# EAGLE design emonDCduo-ESP v2.2 (EAGLE 8.3.1)
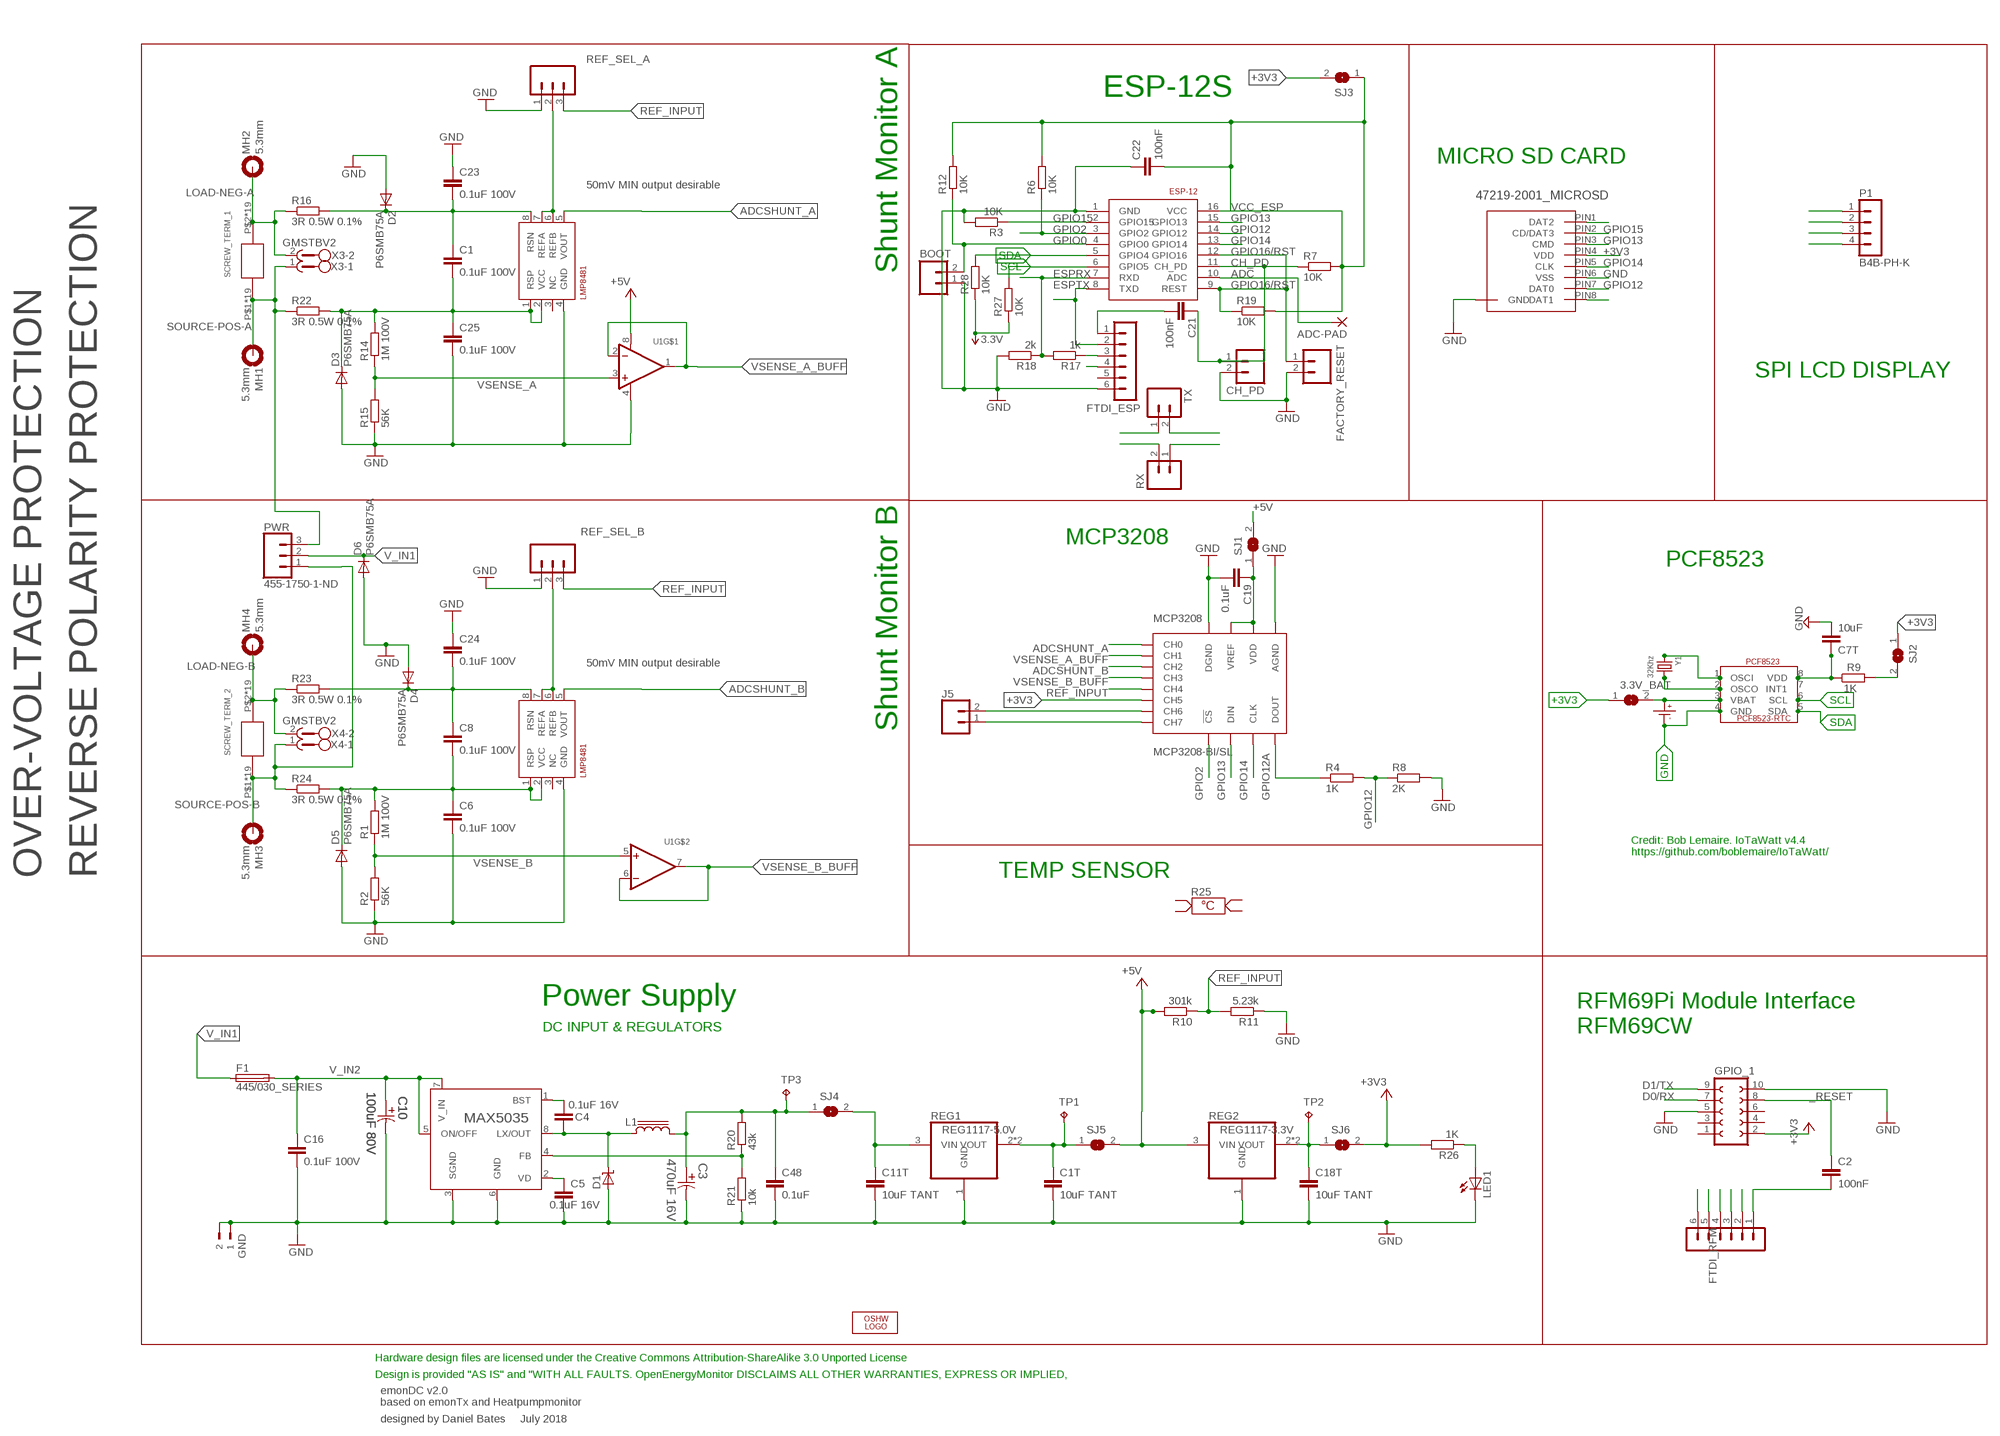
[diagram p0: schematic, sheet 1]

## Parts
3.3V_BAT  SJ-CONCON  [SJ-CON]
ADC-PAD  2,15/1,0  [2,15/1,0]
BOOT  M02PTH  [1X02]
C1  0.1uF 100V  C-EUC0603  [C0603]
C1T  10uF TANT  C-EUC0603  [C0603]
C2  100nF  C-EUC0603  [C0603]
C3  470uF 16V  EEE-FK1C471P-CASE-F  [CAPAE830X1050N]
C4  0.1uF 16V  C-EUC0603  [C0603]
C5  0.1uF 16V  C-EUC0603  [C0603]
C6  0.1uF 100V  C-EUC0603  [C0603]
C7T  10uF  C-EUC0603  [C0603]
C8  0.1uF 100V  C-EUC0603  [C0603]
C10  100uF 80V  EEV-FK1K101Q-CASE-H13  [CAPAE1350X1400N]
C11T  10uF TANT  C-EUC0603  [C0603]
C16  0.1uF 100V  C-EUC0603  [C0603]
C18T  10uF TANT  C-EUC0603  [C0603]
C19  0.1uF  C-EUC0603  [C0603]
C21  100nF  C-EUC0603  [C0603]
C22  100nF  C-EUC0603  [C0603]
C23  0.1uF 100V  C-EUC0603  [C0603]
C24  0.1uF 100V  C-EUC0603  [C0603]
C25  0.1uF 100V  C-EUC0603  [C0603]
C48  0.1uF  C-EUC0603  [C0603]
CH_PD  M02PTH  [1X02]
CR1220  CR1220SMD  [CR1220SMD]
D1  MBRS1100T3G  [SMB_1]
D2  P6SMB75A  DIODE-DO214AA  [DO214AA]
D3  P6SMB75A  DIODE-DO214AA  [DO214AA]
D4  P6SMB75A  DIODE-DO214AA  [DO214AA]
D5  P6SMB75A  DIODE-DO214AA  [DO214AA]
D6  P6SMB75A  DIODE-DO214AA  [DO214AA]
ESP-12  ESP8266_ESP-12  [ESP8266-ESP12]
F1  445/030_SERIES  [445/030_SERIES_LITTELFUSE]
FTDI_ESP  FTDI_ESP  MA06-1  [MA06-1]
FTDI_RFM  FTDI_RFM  MA06-1  [MA06-1]
GND  180-2  [180-2]
GPIO_1  FE05-2_RFM69PI_OUTLINERFM69PI  [FE05-2_RFM69PI_OULTINE]
IO16  FACTORY_RESET  M02PTH  [1X02]
J5  CONN_02  [1X02]
L1  SRR1208  [SSR1208]
LED1  LEDCHIP-LED0805  [CHIP-LED0805]
LOGO1  OSHW_LOGO_6MILX0200-NT  [OSHW_6X200_NOTEXT]
MCP3208  MCP3208-BI/SL  [SOIC16]
MH1  5.3mm  MOUNT-PAD-ROUND5.3  [5,3//11-PAD]
MH2  5.3mm  MOUNT-PAD-ROUND5.3  [5,3//11-PAD]
MH3  5.3mm  MOUNT-PAD-ROUND5.3  [5,3//11-PAD]
MH4  5.3mm  MOUNT-PAD-ROUND5.3  [5,3//11-PAD]
MICRO_SD  47219-2001_MICROSD  [47219-2001_MICROSD]
P1  B4B-PH-K  [B4B-PH-K]
PCF8523  PCF8523_RTC  [SOIC_8]
PWR  455-1750-1-ND  CONN_03  [1X03]
R1  1M 100V  R-EU_R0603  [R0603]
R2  56K  R-EU_R0603  [R0603]
R3  10K  R-EU_R0603  [R0603]
R4  1K  R-EU_R0603  [R0603]
R6  10K  R-EU_R0603  [R0603]
R7  10K  R-EU_R0603  [R0603]
R8  2K  R-EU_R0603  [R0603]
R9  1K  R-EU_R0603  [R0603]
R10  301k  R-EU_0204/7  [0204/7]
R11  5.23k  R-EU_0204/7  [0204/7]
R12  10K  R-EU_R0603  [R0603]
R14  1M 100V  R-EU_R0603  [R0603]
R15  56K  R-EU_R0603  [R0603]
R16  3R 0.5W 0.1%  R-EU_R0805  [R0805]
R17  1k  R-EU_R0603  [R0603]
R18  2k  R-EU_R0603  [R0603]
R19  10K  R-EU_R0603  [R0603]
R20  43k  R-EU_R0603  [R0603]
R21  10k  R-EU_R0603  [R0603]
R22  3R 0.5W 0.1%  R-EU_R0805  [R0805]
R23  3R 0.5W 0.1%  R-EU_R0805  [R0805]
R24  3R 0.5W 0.1%  R-EU_R0805  [R0805]
R25  3220824X  [PT1206]
R26  1K  R-EU_R0603  [R0603]
R27  10K  R-EU_R0603  [R0603]
R28  10K  R-EU_R0603  [R0603]
REF_SEL_A  455-1750-1-ND  CONN_03  [1X03]
REF_SEL_B  455-1750-1-ND  CONN_03  [1X03]
REG0  MAX5035  [21-0111D_SBE-14]
REG1  REG1117-5.0V  REG1117  [SOT223]
REG2  REG1117-3.3V  REG1117  [SOT223]
RX  M02PTH  [1X02]
SCREW_TERM_1  EBW_SERIES_15.2MM  [EBW_SERIES_15.2MM]
SCREW_TERM_2  EBW_SERIES_15.2MM  [EBW_SERIES_15.2MM]
SHUNTMON-A  LMP8481  LMP8481-H  [S-PDSO-G08]
SHUNTMON-B  LMP8481  LMP8481-H  [S-PDSO-G08]
SJ1  SJ-CONCON  [SJ-CON]
SJ2  SJ-CONCON  [SJ-CON]
SJ3  SJ-CONCON  [SJ-CON]
SJ4  SJ-CONCON  [SJ-CON]
SJ5  SJ-CONCON  [SJ-CON]
SJ6  SJ-CONCON  [SJ-CON]
TP1  TPPAD1-13  [P1-13]
TP2  TPPAD1-13  [P1-13]
TP3  TPPAD1-13  [P1-13]
TX  M02PTH  [1X02]
U1  LM358  [SOIC8_150MIL]
X3  GMSTBV2  [GMSTBV2]
X4  GMSTBV2  [GMSTBV2]
Y1  32Khz  CRYSTAL8X3.8SMT  [CRYSTAL_8X3.8]

## Nets
3.3V_PRE: C18T.1 REG2.2(VOUT) REG2.4(VOUT) SJ6.1 TP2.TP
5V_PRE [power]: C1T.1 REG1.2(VOUT) REG1.4(VOUT) SJ5.1 TP1.TP
6.5V: C11T.1 REG1.3(VIN) SJ4.2
+3V3: 3.3V_BAT.1 GPIO_1.2 MCP3208.6(CH5) MICRO_SD.PIN4(VDD) P1.3 R26.2 R27.1 R28.1 SJ2.1 SJ3.2 SJ6.2 ; supply symbol labelled 3.3V
+5V: FTDI_ESP.4 FTDI_RFM.4 R10.2 REG2.3(VIN) SJ1.2 SJ5.2 U1.8(V+)
_RESET: C2.1 GPIO_1.8
ADC: ADC-PAD.1(P) ESP-12.10(ADC)
ADCSHUNT_A: MCP3208.1(CH0) SHUNTMON-A.5(VOUT)
ADCSHUNT_B: MCP3208.3(CH2) SHUNTMON-B.5(VOUT)
BST: C4.1 REG0.1(BST)
CH6: J5.2 MCP3208.7(CH6)
CH7: J5.1 MCP3208.8(CH7)
CH_PD: C21.1 CH_PD.1 ESP-12.11(CH_PD) R7.1
D0/RX: FTDI_RFM.2 GPIO_1.7 TX.2
D1/TX: FTDI_RFM.3 GPIO_1.9 RX.1
ESPRX: ESP-12.7(RXD) R17.2 R18.1 RX.2
ESPTX: ESP-12.8(TXD) FTDI_ESP.2 TX.1
GND [thin_power]: BOOT.1 C1T.2 C3.2 C5.2 C6.2 C7T.2 C10.2 C11T.2 C16.2 C18T.2 C19.2 C22.1 C23.1 C24.1 C25.2 C48.2 CH_PD.2 CR1220.P-(P$-) D1.A D2.A D3.A D4.A D5.A D6.A ESP-12.1(GND) FTDI_ESP.6 FTDI_RFM.6 GND.1 GND.2 GPIO_1.5 GPIO_1.10 IO16.2 LED1.C MCP3208.9(DGND) MCP3208.14(AGND) MICRO_SD.P$1(GND) MICRO_SD.P$2(GND) MICRO_SD.P$3(GND) MICRO_SD.P$4(GND) MICRO_SD.PIN6(VSS) P1.4 PCF8523.4(GND) R2.1 R3.2 R8.2 R11.1 R15.1 R18.2 R21.1 REF_SEL_A.1 REF_SEL_B.1 REG0.3(SGND) REG0.6(GND) REG1.1(GND) REG2.1(GND) SHUNTMON-A.4(GND) SHUNTMON-B.4(GND) U1.4(V-)
GPIO0: BOOT.2 ESP-12.4(GPIO0) R12.1
GPIO2: ESP-12.3(GPIO2) MCP3208.10(!CS) R6.1
GPIO12: ESP-12.14(GPIO12) MICRO_SD.PIN7(DAT0) R4.2 R8.1
GPIO12A: MCP3208.12(DOUT) R4.1
GPIO13: ESP-12.15(GPIO13) MCP3208.11(DIN) MICRO_SD.PIN3(CMD)
GPIO14: ESP-12.13(GPIO14) MCP3208.13(CLK) MICRO_SD.PIN5(CLK)
GPIO15 [thin_power]: ESP-12.2(GPIO15) MICRO_SD.PIN2(CD/DAT3) R3.1
GPIO16/RST: ESP-12.9(REST) ESP-12.12(GPIO16) IO16.1 R19.1
LOAD-NEG-A: MH2.B5,5(MOUNT) R16.1 SCREW_TERM_1.P$2 SCREW_TERM_1.P$18 SCREW_TERM_1.P$19 SCREW_TERM_1.P$20 SCREW_TERM_1.P$21 SCREW_TERM_1.P$22 SCREW_TERM_1.P$23 SCREW_TERM_1.P$24 SCREW_TERM_1.P$25 SCREW_TERM_1.P$26 SCREW_TERM_1.P$27 SCREW_TERM_1.P$28 SCREW_TERM_1.P$29 SCREW_TERM_1.P$30 SCREW_TERM_1.P$31 SCREW_TERM_1.P$32 SCREW_TERM_1.P$36 SCREW_TERM_1.P$37 SCREW_TERM_1.P$38 X3.2
LOAD-NEG-B: MH4.B5,5(MOUNT) R23.1 SCREW_TERM_2.P$2 SCREW_TERM_2.P$18 SCREW_TERM_2.P$19 SCREW_TERM_2.P$20 SCREW_TERM_2.P$21 SCREW_TERM_2.P$22 SCREW_TERM_2.P$23 SCREW_TERM_2.P$24 SCREW_TERM_2.P$25 SCREW_TERM_2.P$26 SCREW_TERM_2.P$27 SCREW_TERM_2.P$28 SCREW_TERM_2.P$29 SCREW_TERM_2.P$30 SCREW_TERM_2.P$31 SCREW_TERM_2.P$32 SCREW_TERM_2.P$36 SCREW_TERM_2.P$37 SCREW_TERM_2.P$38 X4.2
LX: C4.2 D1.C L1.1 REG0.8(LX/OUT)
MCP_VCC [power]: C19.1 MCP3208.15(VREF) MCP3208.16(VDD) SJ1.1
N$1: R20.1 R21.2 REG0.4(FB)
N$5: LED1.A R26.1
N$7: MICRO_SD.PIN1(DAT2)
N$10: C7T.1 PCF8523.8(VDD) R9.1
N$17: C1.1 C23.2 D2.C R16.2 SHUNTMON-A.8(RSN)
N$20: FTDI_RFM.5
N$22: C8.1 C24.2 D4.C R23.2 SHUNTMON-B.8(RSN)
N$23: C1.2 C25.1 D3.C R14.2 R22.2 SHUNTMON-A.1(RSP) SHUNTMON-A.2(VCC)
N$24: R9.2 SJ2.2
N$30: C21.2 FTDI_ESP.1
N$32: MICRO_SD.PIN8(DAT1)
N$36: FTDI_ESP.3 R17.1
N$44: PCF8523.2(OSCO) Y1.P$4
N$45: PCF8523.1(OSCI) Y1.P$1
N$301: C2.2 FTDI_RFM.1
PRE_6.5V: C3.1 C48.1 L1.2 R20.2 SJ4.1 TP3.TP
REF_A_INPUT: REF_SEL_A.2 SHUNTMON-A.6(REFB) SHUNTMON-A.7(REFA)
REF_B_INPUT [thin_power]: REF_SEL_B.2 SHUNTMON-B.6(REFB) SHUNTMON-B.7(REFA)
REF_INPUT: MCP3208.5(CH4) R10.1 R11.2 REF_SEL_A.3 REF_SEL_B.3
SCL: ESP-12.6(GPIO5) P1.2 PCF8523.6(SCL) R27.2
SDA: ESP-12.5(GPIO4) P1.1 PCF8523.5(SDA) R28.2
SOURCE-POS-A: MH1.B5,5(MOUNT) PWR.3 R22.1 SCREW_TERM_1.P$1 SCREW_TERM_1.P$3 SCREW_TERM_1.P$4 SCREW_TERM_1.P$5 SCREW_TERM_1.P$6 SCREW_TERM_1.P$7 SCREW_TERM_1.P$8 SCREW_TERM_1.P$9 SCREW_TERM_1.P$10 SCREW_TERM_1.P$11 SCREW_TERM_1.P$12 SCREW_TERM_1.P$13 SCREW_TERM_1.P$14 SCREW_TERM_1.P$15 SCREW_TERM_1.P$16 SCREW_TERM_1.P$17 SCREW_TERM_1.P$33 SCREW_TERM_1.P$34 SCREW_TERM_1.P$35 X3.1
SOURCE-POS-B [power]: MH3.B5,5(MOUNT) PWR.1 R24.1 SCREW_TERM_2.P$1 SCREW_TERM_2.P$3 SCREW_TERM_2.P$4 SCREW_TERM_2.P$5 SCREW_TERM_2.P$6 SCREW_TERM_2.P$7 SCREW_TERM_2.P$8 SCREW_TERM_2.P$9 SCREW_TERM_2.P$10 SCREW_TERM_2.P$11 SCREW_TERM_2.P$12 SCREW_TERM_2.P$13 SCREW_TERM_2.P$14 SCREW_TERM_2.P$15 SCREW_TERM_2.P$16 SCREW_TERM_2.P$17 SCREW_TERM_2.P$33 SCREW_TERM_2.P$34 SCREW_TERM_2.P$35 X4.1
SOURCE-POS-B_T: C6.1 C8.2 D5.C R1.2 R24.2 SHUNTMON-B.1(RSP) SHUNTMON-B.2(VCC)
V_IN1: D6.C F1.P$1 F1.P$2 PWR.2
V_IN2: C10.1 C16.1 F1.P$3 F1.P$4 REG0.5(ON/OFF) REG0.7(V_IN)
VBAT: 3.3V_BAT.2 CR1220.P+(P$+) PCF8523.3(VBAT)
VCC_ESP: C22.2 ESP-12.16(VCC) R6.2 R7.2 R12.2 R19.2 SJ3.1
VD: C5.1 REG0.2(VD)
VSENSE_A: R14.1 R15.2 U1.3(+IN)
VSENSE_A_BUFF: MCP3208.2(CH1) U1.1(OUT) U1.2(-IN)
VSENSE_B: R1.1 R2.2 U1.5(+IN)
VSENSE_B_BUFF: MCP3208.4(CH3) U1.6(-IN) U1.7(OUT)
Unconnected: FTDI_ESP.5 GPIO_1.1 GPIO_1.3 GPIO_1.4 GPIO_1.6 PCF8523.7(INT1) R25.1A(PT100-A1) R25.1B(PT100-A2) R25.2A(PT100-B1) R25.2B(PT100-B2) SHUNTMON-A.3(NC) SHUNTMON-B.3(NC)

## Notes on the sheet
- ESP-12S
- MICRO SD CARD
- 50mV MIN output desirable
- Shunt Monitor A
- SPI LCD DISPLAY
- MCP3208
- PCF8523
- 50mV MIN output desirable
- Shunt Monitor B
- Credit: Bob Lemaire. IoTaWatt v4.4
  https://github.com/boblemaire/IoTaWatt/
- OVER-VOLTAGE PROTECTION | REVERSE POLARITY PROTECTION | TEMP SENSOR
- Power Supply
- DC INPUT & REGULATORS
- RFM69Pi Module Interface
  RFM69CW
- Hardware design files are licensed under the Creative Commons Attribution-ShareAlike 3.0 Unported License
- Design is provided "AS IS" and "WITH ALL FAULTS. OpenEnergyMonitor DISCLAIMS ALL OTHER WARRANTIES, EXPRESS OR IMPLIED,
- emonDC v2.0
  based on emonTx and Heatpumpmonitor
- designed by Daniel Bates     July 2018

## Library data of the parts
3.3V_BAT SJ4 = jumper-con:SJ-CON: SMD solder JUMPER
ADC-PAD = wirepad:2,15/1,0: THROUGH-HOLE PAD
BOOT CH_PD IO16 RX TX = SparkFun:M02: Header 2 Standard 2-pin 0.1" header. Use with straight break away headers (SKU : PRT-00116), right angle break away headers (PRT-00553), swiss pins (PRT-00743), machine pins (PRT-00117), and female headers (PRT-00115). Molex polarized connector foot print use with SKU : PRT-08233 with associated crimp pins and housings.
C1 C6 C8 C23-C25 = rcl:C-EU: CAPACITOR, European symbol; MPN: C1608X7S2A104K080AB
C1T C2 C4 C5 C11T C16 C18T C19 C21 C22 C48 = rcl:C-EU: CAPACITOR, European symbol
C3 = Panasonic-EEEFK_EEEFP:EEE-: Aluminum Electrolytic Capacitors,Surface Mount Type; MPN: EEE-FK1C471P; OC_FARNELL: 9695710; OC_NEWARK: 96K9385; PACKAGE: CASE-F; SUPPLIER: PANASONIC; TOLERANCE: ±20 %; VALUE: 470UF; VOLTAGERATING: 16V
C7T = rcl@1:C-EU: CAPACITOR, European symbol
C10 = Panasonic-EEE-EEV-EEF-ECQ:EEV-: Aluminum Electrolytic Capacitors,Surface Mount Type; MPN: EEVFK1K101Q; OC_FARNELL: 9696113; OC_NEWARK: 96K9484; SUPPLIER: PANASONIC; TOLERANCE: ±20 %; VALUE: 100UF; VOLTAGERATING: 80V
CR1220 = IotaWatt_parts:CR1220SMD: CR1220 Battery SMD; MPN: Harwin S8411-45R
D1 = diodes:MBRS1100T3G: MBRS1100T3G 100V 1A Freewheeling Diode; MPN: MBRS1100T3G
D2-D6 = diode:DIODE-: DIODE
ESP-12 = ESP8266-ESP12:ESP8266_ESP-12
F1 = LITTELFUSE 455:030 SERIES:445/030_SERIES: MPN 04450001N
FTDI_ESP FTDI_RFM = JeeLabs:MA06-1: PIN HEADER
GND = con-weidmueller-sl35_db:180-2: WEIDMUELLER CLAMP CONNECTOR; OC_FARNELL: unknown; OC_NEWARK: unknown
GPIO_1 = con-lsta-RFM69Pi:FE05-2_RFM69PI_OUTLINE: FEMALE HEADER
J5 = SparkFun-Connectors:CONN_02: Multi connection point. Often used as Generic Header-pin footprint for 0.1 inch spaced/style header connections On any of the 0.1 inch spaced packages, you can populate with these: Break Away Headers - Straight <https://www.sparkfun.com/products/116> (PRT-00116) Break Away Male Headers - Right Angle <https://www.sparkfun.com/products/553> (PRT-00553) Female Headers <https://www.sparkfun.com/products/115> (PRT-00115) Break Away Headers - Machine Pin <https://www.sparkfun.com/products/117> (PRT-00117) Break Away Female Headers - Swiss Machine Pin <https://www.sparkfun.com/products/743> (PRT-00743) For SCREWTERMINALS and SPRING TERMINALS visit here: Screw Terimnals on SparkFun.com <https://www.sparkfun.com/search/results?term=Screw+Terminals> (5mm/3.5mm/2.54mm spacing) This device is also useful as a general connection point to wire up your design to another part of your project. Our various solder wires solder well into these plated through hole pads. Hook-Up Wire - Assortment (Stranded, 22 AWG) <https://www.sparkfun.com/products/11375> (PRT-11375) Hook-Up Wire - Assortment (Solid Core, 22 AWG) <https://www.sparkfun.com/products/11367> (PRT-11367) View the entire wire category on our website here <https://www.sparkfun.com/categories/141> Special notes: Molex polarized connector foot print use with: PRT-08233 with associated crimp pins and housings. 2.54_SCREWTERM for use with PRT-10571. 3.5mm Screw Terminal footprints for PRT-08084 5mm Screw Terminal footprints for use with PRT-08432
L1 = inductor-bourns:SRR1208: POWER INDUCTOR; MPN: SRR1208-151YL
LED1 = led:LED: LED OSRAM: - CHIPLED LG R971, LG N971, LY N971, LG Q971, LY Q971, LO R971, LY R971 LH N974, LH R974 LS Q976, LO Q976, LY Q976 LO Q996 - Hyper CHIPLED LW Q18S LB Q993, LB Q99A, LB R99A - SideLED LS A670, LO A670, LY A670, LG A670, LP A670 LB A673, LV A673, LT A673, LW A673 LH A674 LY A675 LS A676, LA A676, LO A676, LY A676, LW A676 LS A679, LY A679, LG A679 - Hyper Micro SIDELED® LS Y876, LA Y876, LO Y876, LY Y876 LT Y87S - SmartLED LW L88C, LW L88S LB L89C, LB L89S, LG L890 LS L89K, LO L89K, LY L89K LS L896, LA L896, LO L896, LY L896 - TOPLED LS T670, LO T670, LY T670, LG T670, LP T670 LSG T670, LSP T670, LSY T670, LOP T670, LYG T670 LG T671, LOG T671, LSG T671 LB T673, LV T673, LT T673, LW T673 LH T674 LS T676, LA T676, LO T676, LY T676, LB T676, LH T676, LSB T676, LW T676 LB T67C, LV T67C, LT T67C, LS T67K, LO T67K, LY T67K, LW E67C LS E67B, LA E67B, LO E67B, LY E67B, LB E67C, LV E67C, LT E67C LW T67C LS T679, LY T679, LG T679 LS T770, LO T770, LY T770, LG T770, LP T770 LB T773, LV T773, LT T773, LW T773 LH T774 LS E675, LA E675, LY E675, LS T675 LS T776, LA T776, LO T776, LY T776, LB T776 LHGB T686 LT T68C, LB T68C - Hyper Mini TOPLED® LB M676 - Mini TOPLED Santana® LG M470 LS M47K, LO M47K, LY M47K Source: http://www.osram.convergy.de LUXEON: - LUMILED® LXK2-PW12-R00, LXK2-PW12-S00, LXK2-PW14-U00, LXK2-PW14-V00 LXK2-PM12-R00, LXK2-PM12-S00, LXK2-PM14-U00 LXK2-PE12-Q00, LXK2-PE12-R00, LXK2-PE12-S00, LXK2-PE14-T00, LXK2-PE14-U00 LXK2-PB12-K00, LXK2-PB12-L00, LXK2-PB12-M00, LXK2-PB14-N00, LXK2-PB14-P00, LXK2-PB14-Q00 LXK2-PR12-L00, LXK2-PR12-M00, LXK2-PR14-Q00, LXK2-PR14-R00 LXK2-PD12-Q00, LXK2-PD12-R00, LXK2-PD12-S00 LXK2-PH12-R00, LXK2-PH12-S00 LXK2-PL12-P00, LXK2-PL12-Q00, LXK2-PL12-R00 Source: www.luxeon.com KINGBRIGHT: KA-3528ASYC Source: www.kingbright.com
LOGO1 = ohw-logo:OSHW_LOGO_6MIL; OC_FARNELL: unknown
MCP3208 = MCP3208:MCP3208
MH1-MH4 = holes-db:MOUNT-PAD-ROUND: MOUNTING PAD, round
MICRO_SD = MOLEX 47219-2001:47219-2001_MICROSD
P1 = JST-PH:B4B-PH-K: HEADER
PCF8523 = emonDC parts:PCF8523_RTC: PCF8523-RTC SOIC-8
PWR = SparkFun-Connectors:CONN_03: Multi connection point. Often used as Generic Header-pin footprint for 0.1 inch spaced/style header connections On any of the 0.1 inch spaced packages, you can populate with these: Break Away Headers - Straight <https://www.sparkfun.com/products/116> (PRT-00116) Break Away Male Headers - Right Angle <https://www.sparkfun.com/products/553> (PRT-00553) Female Headers <https://www.sparkfun.com/products/115> (PRT-00115) Break Away Headers - Machine Pin <https://www.sparkfun.com/products/117> (PRT-00117) Break Away Female Headers - Swiss Machine Pin <https://www.sparkfun.com/products/743> (PRT-00743) Stackable Header - 3 Pin (Female, 0.1") <https://www.sparkfun.com/products/13875> (PRT-13875) For SCREWTERMINALS and SPRING TERMINALS visit here: Screw Terimnals on SparkFun.com <https://www.sparkfun.com/search/results?term=Screw+Terminals> (5mm/3.5mm/2.54mm spacing) This device is also useful as a general connection point to wire up your design to another part of your project. Our various solder wires solder well into these plated through hole pads. Hook-Up Wire - Assortment (Stranded, 22 AWG) <https://www.sparkfun.com/products/11375> (PRT-11375) Hook-Up Wire - Assortment (Solid Core, 22 AWG) <https://www.sparkfun.com/products/11367> (PRT-11367) View the entire wire category on our website here <https://www.sparkfun.com/categories/141> Special notes: Molex polarized connector foot print use with SKU : PRT-08232 with associated crimp pins and housings.; PROD_ID: XXX-00000
R1 R14 = rcl:R-EU_: RESISTOR, European symbol; MPN: MCWR06X1003FTL
R2 R4 R8 R15 = rcl:R-EU_: RESISTOR, European symbol; MPN: MCWR06X5901FTL
R3 R6 R7 R12 R17-R19 R27 R28 = rcl:R-EU_: RESISTOR, European symbol
R9 R20 R21 = rcl@1:R-EU_: RESISTOR, European symbol
R10 R11 R16 R22-R24 R26 = rcl:R-EU_: RESISTOR, European symbol; SPICEPREFIX: R
R25 = sensor-heraeus:3220824X: PT100 TEMPERATURE SENSOR; OC_FARNELL: unknown; OC_NEWARK: unknown
REF_SEL_A REF_SEL_B = SparkFun-Connectors:CONN_03: Multi connection point. Often used as Generic Header-pin footprint for 0.1 inch spaced/style header connections On any of the 0.1 inch spaced packages, you can populate with these: Break Away Headers - Straight <https://www.sparkfun.com/products/116> (PRT-00116) Break Away Male Headers - Right Angle <https://www.sparkfun.com/products/553> (PRT-00553) Female Headers <https://www.sparkfun.com/products/115> (PRT-00115) Break Away Headers - Machine Pin <https://www.sparkfun.com/products/117> (PRT-00117) Break Away Female Headers - Swiss Machine Pin <https://www.sparkfun.com/products/743> (PRT-00743) Stackable Header - 3 Pin (Female, 0.1") <https://www.sparkfun.com/products/13875> (PRT-13875) For SCREWTERMINALS and SPRING TERMINALS visit here: Screw Terimnals on SparkFun.com <https://www.sparkfun.com/search/results?term=Screw+Terminals> (5mm/3.5mm/2.54mm spacing) This device is also useful as a general connection point to wire up your design to another part of your project. Our various solder wires solder well into these plated through hole pads. Hook-Up Wire - Assortment (Stranded, 22 AWG) <https://www.sparkfun.com/products/11375> (PRT-11375) Hook-Up Wire - Assortment (Solid Core, 22 AWG) <https://www.sparkfun.com/products/11367> (PRT-11367) View the entire wire category on our website here <https://www.sparkfun.com/categories/141> Special notes: Molex polarized connector foot print use with SKU : PRT-08232 with associated crimp pins and housings.; MF: MULTICOMP; MPN: 2212S-02SG-85; OC_FARNELL: 1593458; PROD_ID: XXX-00000
REG0 = MAX5035:MAX5035: SWITCHING REGULATOR 5.0V 1.0A; MPN: MAX5035EASA+
REG1 = burr-brown-db:REG1117: 800mA and 1A Low Dropout (LDO) Positive Regulator 1.8V, 2.5V, 2.85V, 3.3V, 5V, and Adj; MF: TEXAS INSTRUMENTS; MPN: REG1117-5.0; OC_FARNELL: 1097566; OC_NEWARK: 14P6981
REG2 = burr-brown-db:REG1117: 800mA and 1A Low Dropout (LDO) Positive Regulator 1.8V, 2.5V, 2.85V, 3.3V, 5V, and Adj; MF: TEXAS INSTRUMENTS; MPN: REG1117-3.3; OC_FARNELL: 1097566; OC_NEWARK: 14P6981
SCREW_TERM_1 SCREW_TERM_2 = EBW series SHUNT:EBW_SERIES_15.2MM
SHUNTMON-A = lmp8481b:LMP8481: LMP8481MM-H/NOPB 100V/V; MF: TEXAS INSTRUMENTS; MPN: LMP8481MME-S/NOPB; OC_FARNELL: 2322044
SHUNTMON-B = lmp8481b:LMP8481: LMP8481MM-H/NOPB 100V/V; MF: TEXAS INSTRUMENTS; MPN: LMP8481MME-H/NOPB; OC_FARNELL: 2322044
SJ1-SJ3 SJ5 SJ6 = jumper-con_db:SJ-CON: SMD solder JUMPER
TP1-TP3 = testpad:TP: Test pad
U1 = microbuilder:LM358: LM358 Dual Operational Amplifier Digikey: LM358AMXFSCT-ND
X3 X4 = con-phoenix-762:GMSTBV2: PHOENIX; MPN: GMSTBVA2,5/2-G-7,62; OC_FARNELL: 1793079; OC_NEWARK: 69R9520
Y1 = microbuilder:CRYSTAL: Crystals HC49UP - Surface Mount Crystal 4.0MHz 18pF +/-30ppm Surface Mount Crystal [Digikey: 535-9857-1-ND] 12.0 MHz Surface Mount Crystal [Digikey: 535-9869-6-ND] 25.0 MHz Surface Mount Crystal [Digikey: 535-9078-1-ND] 2.5 x 2.0mm - MEMs SMT Crystal 16.0 MHz 10pF 20ppm 2.5 x 2.0mm Crystal [Digikey -40-85°C: 535-10923-1-ND] 3.2 x 2.5mm - MEMs SMT Crystal 12.0 MHz 8pF 15ppm 3.2 x 2.5mm Crystal [Digikey: -10-70°C: 644-1047-1-ND -40-125°C: 644-1128-1-ND] 16.0 MHz 8pF 15ppm 3.2 x 2.5mm Crystal [Digikey: -10-70°C: 644-1049-1-ND -40-125°C: 644-1129-2-ND] 16.0 MHz 10pF 10ppm 3.2 x 2.5mm Crystal [Digikey: 644-1100-1-ND] 27.12 MHz 18pF 30ppm 3.2 x 2.5mm Crystal [Digikey: 887-1424-1-ND] 27.12MHz 10pF 10ppm 3.2 x 2.5mm Crystal [Digikey: 887-1329-1-ND] 4.9 x 1.8mm - MEMs SMT Crystal 32.768 KHz 12.5pF 20ppm 4.9 x 1.8mm Crystal [Digikey: SE2415CT-ND] 8.0 x 3.8mm - Surface Mount Crystal 32.768kHz 12.5pF 20ppm -40°C-85°C [Digikey: 535-9166-2-ND] Cylinder 32.768KHz Cylinder Crystal (2x6mm body) [Ex. Digikey: 300-8341-2-ND]

## Net classes
2 thin_power: width 0.254 mm

## Board
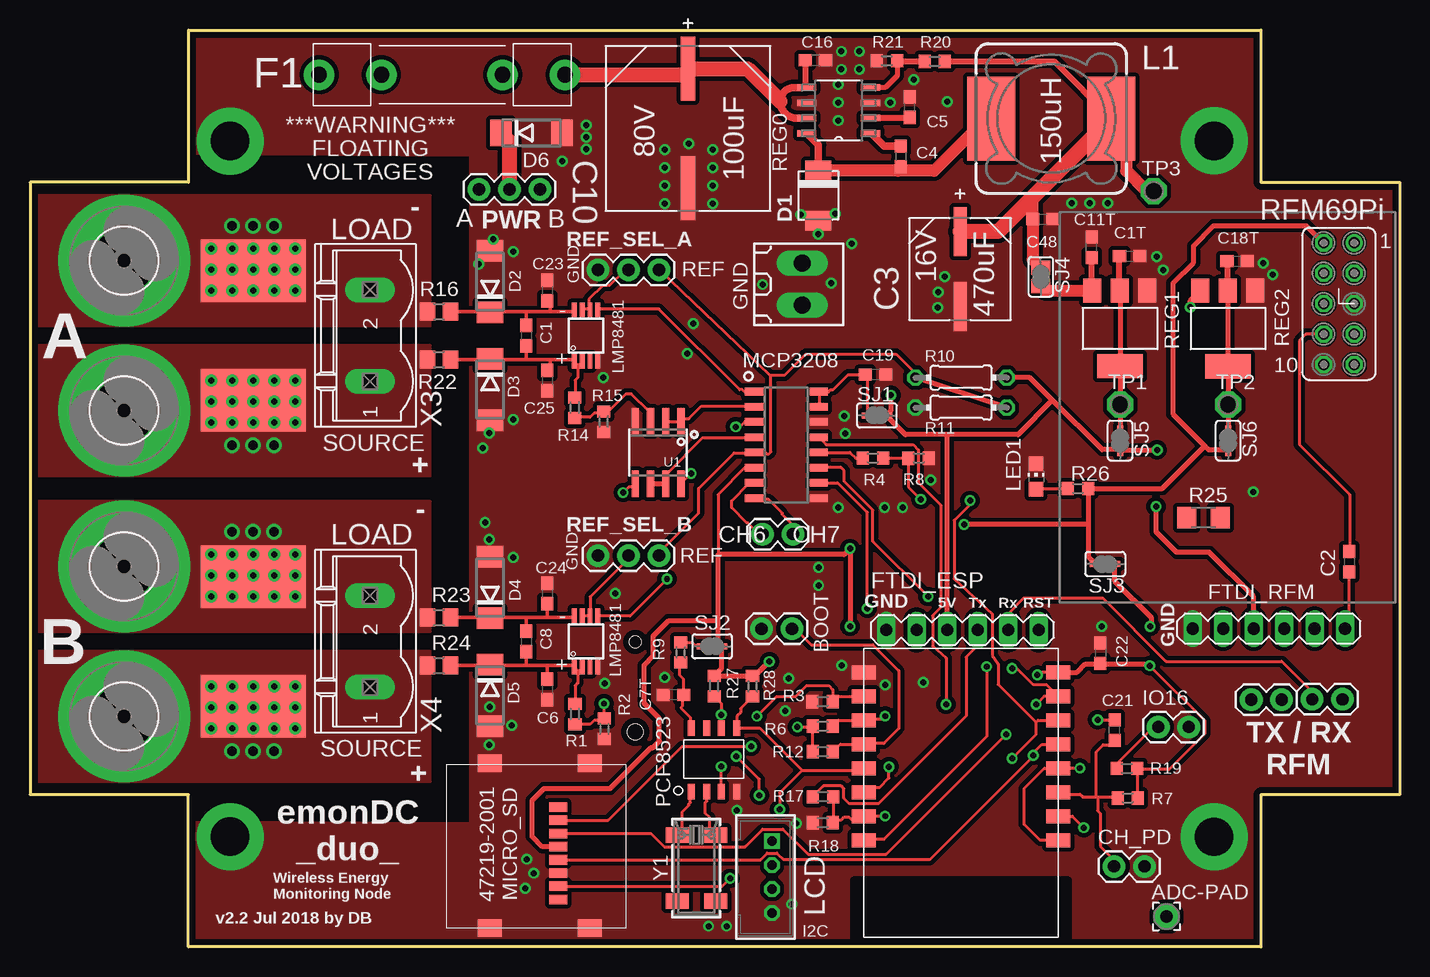
[diagram p1: board, top side]
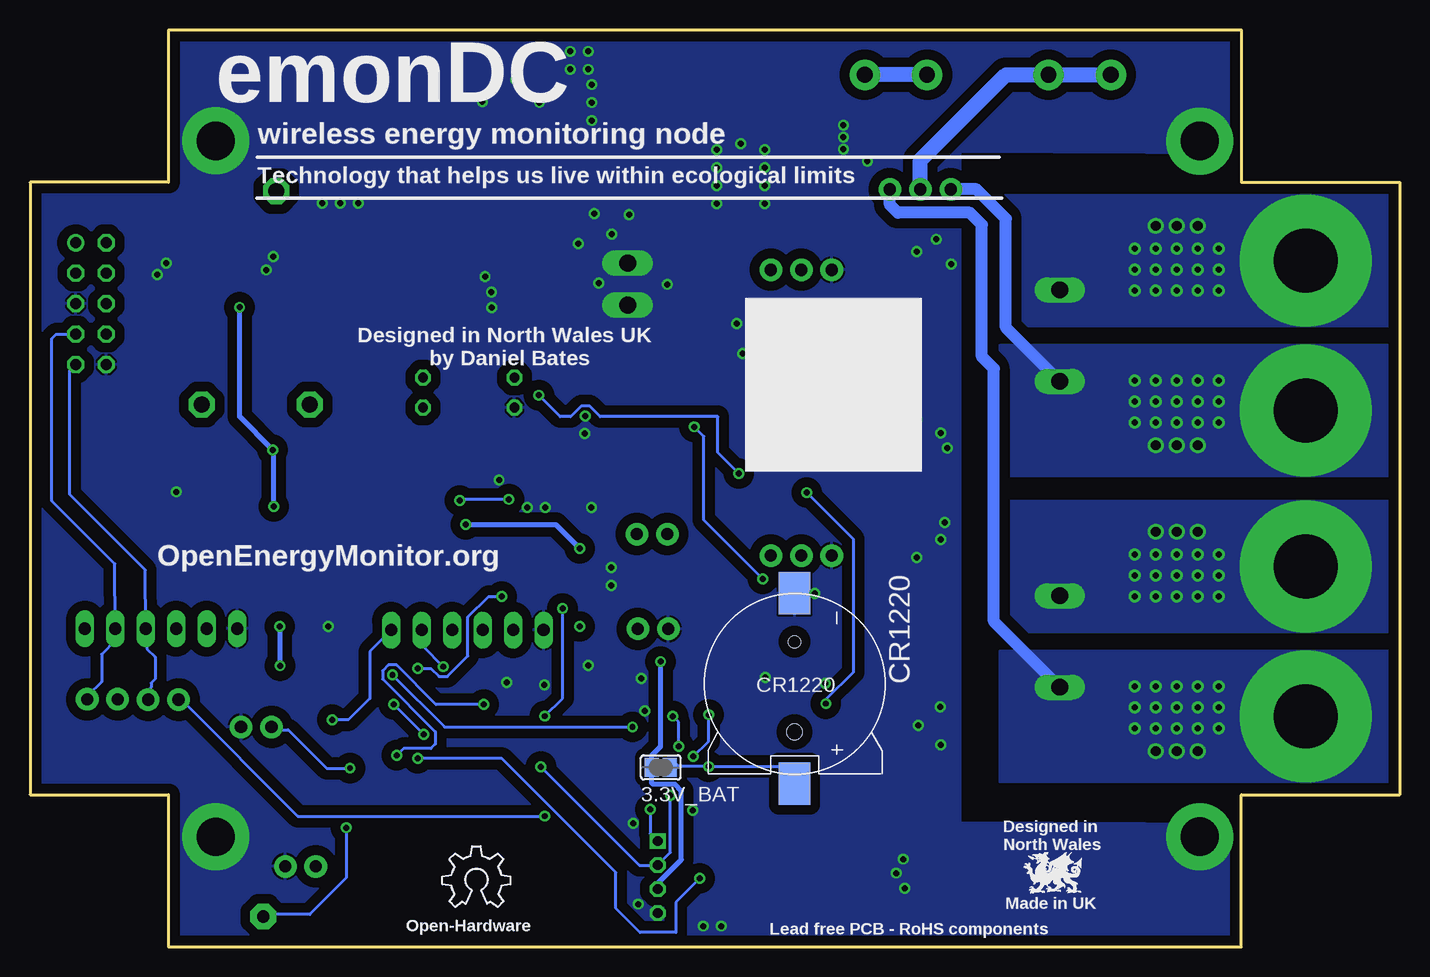
[diagram p2: board, bottom side, seen from below]

Size 114.15 x 76.45 mm. Coordinates in mm from the lower left corner, seen from the top.
Outline: 13.2,76.45 13.2,63.75 0,63.75 0,12.7 13.2,12.7 13.2,0 102.6,0 102.6,12.7 114.15,12.7 114.15,63.75 102.6,63.75 102.6,76.45 13.2,76.45
Copper layers (1*16): Top 0.035mm / dielectric 1.5mm / Bottom 0.035mm
Design rules "defaultDB *": minimum track width 10mil, minimum drill 19mil, track to track 8mil, track to pad 8mil, pad to pad 8mil, via to via 10mil, smd to smd 8mil, copper to edge 20mil, drill to drill 10mil, minimum pad ring 10mil, minimum via ring 8mil, stop-mask expansion 4mil, vias tented up to drill 0mil, thermal gap 7mil
tRestrict: area 68.7,0.2 to 86.5,5.6
bRestrict: area 68.7,0.2 to 86.5,5.6

### Footprints (pad centres in the part's own frame; a part is rotated, then mirrored left to right if it is on the bottom)
SJ-CON = smd 1.168 x 1.6: 1 -0.762,0; 2 0.762,0
2,15/1,0 = drill 1.016 pad 2.159 octagon: 1 0,0
1X02 = drill 1.016 pad 1.88: 1 0,0; 2 2.54,0
C0603 = smd 1.1 x 1: 1 -0.85,0; 2 0.85,0
CAPAE830X1050N = smd 4.064 x 1.092: 1 -3.124,0; 2 3.124,0
CAPAE1350X1400N = smd 5.359 x 1.194: 1 -4.978,0; 2 4.978,0
CR1220SMD = smd 3.54 x 2.6: P+ 8.3,0; P- -7.55,0 | hole 1: -3.5,0 | hole 1.3: 4,0
SMB_1 = smd 1.62 x 2.18: A 2.11,0; C -2.11,0
DO214AA = smd 1.8 x 2.2: A 2.55,0; C -2.55,0
ESP8266-ESP12 = smd 2 x 1.2: 1 16.2,2; 2 16.2,4; 3 16.2,6; 4 16.2,8; 5 16.2,10; 6 16.2,12; 7 16.2,14; 8 16.2,16; 9 0,16; 10 0,14; 11 0,12; 12 0,10; 13 0,8; 14 0,6; 15 0,4; 16 0,2
445/030_SERIES_LITTELFUSE = drill 1.3 pad 2.54: P$1 -10.25,0; P$2 -5.05,0; P$3 10.25,0; P$4 5.05,0
MA06-1 = drill 1.016 long: 1 0,0; 2 2.54,0; 3 5.08,0; 4 7.62,0; 5 10.16,0; 6 12.7,0
180-2 = drill 1.422 long: 1 -1.75,0; 2 1.75,0
FE05-2_RFM69PI_OULTINE = drill 0.914: 1 24.511,29.972 | drill 0.914 octagon: 2 21.971,29.972; 3 24.511,27.432; 4 21.971,27.432; 5 24.511,24.892; 6 21.971,24.892; 7 24.511,22.352; 8 21.971,22.352; 9 24.511,19.812; 10 21.971,19.812
SSR1208 = smd 7 x 4: 1 0,5; 2 0,-5
CHIP-LED0805 = smd 1.2 x 1.2: A 0,-1.05; C 0,1.05
SOIC16 = smd 0.635 x 1.524: 1 -4.445,-2.695; 2 -3.175,-2.695; 3 -1.905,-2.695; 4 -0.635,-2.695; 5 0.635,-2.695; 6 1.905,-2.695; 7 3.175,-2.695; 8 4.445,-2.695; 9 4.445,2.695; 10 3.175,2.695; 11 1.905,2.695; 12 0.635,2.695; 13 -0.635,2.695; 14 -1.905,2.695; 15 -3.175,2.695; 16 -4.445,2.695
5,3//11-PAD = drill 5.3 pad 11: B5,5 0,0
47219-2001_MICROSD = smd 1.45 x 2: P$1 0,0; P$2 13.75,0; P$3 0,8.3; P$4 13.75,8.3 | smd 0.8 x 1.5: PIN1 10.08,2.6; PIN2 8.98,2.6; PIN3 7.88,2.6; PIN4 6.78,2.6; PIN5 5.68,2.6; PIN6 4.58,2.6; PIN7 3.48,2.6; PIN8 2.38,2.6
B4B-PH-K = drill 0.813 square: 1 -3,0 | drill 0.813 octagon: 2 -1,0; 3 1,0; 4 3,0
SOIC_8 = smd 1.3 x 0.6: 1 -2.6,1.9; 2 -2.6,0.6; 3 -2.6,-0.6; 4 -2.6,-1.9; 5 2.7,-1.9; 6 2.7,-0.6; 7 2.7,0.6; 8 2.7,1.9
1X03 = drill 1.016 pad 1.88: 1 0,0; 2 2.54,0; 3 5.08,0
R0603 = smd 1 x 1.1: 1 -0.85,0; 2 0.85,0
0204/7 = drill 0.813 octagon: 1 -3.81,0; 2 3.81,0
R0805 = smd 1.3 x 1.5: 1 -0.95,0; 2 0.95,0
PT1206 = smd 1.6 x 1: 1A -1.4,-0.4; 1B -1.4,0.4; 2A 1.4,-0.4; 2B 1.4,0.4
21-0111D_SBE-14 = smd 1.6 x 0.533: 1 -2.654,1.905; 2 -2.654,0.635; 3 -2.654,-0.635; 4 -2.654,-1.905; 5 2.654,-1.905; 6 2.654,-0.635; 7 2.654,0.635; 8 2.654,1.905
SOT223 = smd 1.499 x 2.007: 1 -2.261,-3.15; 2 0.025,-3.15; 3 2.311,-3.15 | smd 3.81 x 2.007: 4 0,3.15
EBW_SERIES_15.2MM = smd 5.2 x 8.75: P$1 -5.4,0; P$2 5.4,0 | drill 0.5: P$3 -3.75,3.5; P$4 -3.75,1.75; P$5 -3.75,0; P$6 -3.75,-1.75; P$7 -3.75,-3.5; P$8 -5.5,3.5; P$9 -5.5,1.75; P$10 -5.5,0; P$11 -5.5,-1.75; P$12 -5.5,-3.5; P$13 -7.25,3.5; P$14 -7.25,1.75; P$15 -7.25,0; P$16 -7.25,-1.75; P$17 -7.25,-3.5; P$18 7.25,1.75; P$19 7.25,3.5; P$20 7.25,0; P$21 7.25,-1.75; P$22 7.25,-3.5; P$23 5.5,3.5; P$24 5.5,1.75; P$25 5.5,0; P$26 5.5,-1.75; P$27 5.5,-3.5; P$28 3.75,3.5; P$29 3.75,1.75; P$30 3.75,0; P$31 3.75,-1.75; P$32 3.75,-3.5 | drill 0.8: P$33 -9.155,1.75; P$34 -9.155,0; P$35 -9.155,-1.75; P$36 9.155,1.75; P$37 9.155,0; P$38 9.155,-1.75
S-PDSO-G08 = smd 0.4 x 1.2: 1 -0.975,-2.157; 2 -0.325,-2.157; 3 0.325,-2.157; 4 0.975,-2.157; 5 0.975,2.157; 6 0.325,2.157; 7 -0.325,2.157; 8 -0.975,2.157
SJ-CON' = smd 1.016 x 0.508: 1 -0.762,0; 2 0.762,0
P1-13 = drill 1.321 pad 2.159 octagon: TP 0,0
SOIC8_150MIL = smd 0.6 x 2.2: 1 -1.905,-2.6; 2 -0.635,-2.6; 3 0.635,-2.6; 4 1.905,-2.6; 5 1.905,2.6; 6 0.635,2.6; 7 -0.635,2.6; 8 -1.905,2.6
GMSTBV2 = drill 1.397 long: 1 -3.81,0; 2 3.81,0
CRYSTAL_8X3.8 = smd 1.3 x 1.9: P$1 -2.75,-1.6; P$2 2.75,-1.6; P$3 2.75,1.6; P$4 -2.75,1.6

### Placement (x,y rotation side)
3.3V_BAT  61.59,14.97 0 bottom
ADC-PAD  94.71,2.54 0 top
BOOT  60.96,26.53 0 top
C1  41.34,50.97 270 top
C1T  91.63,57.59 0 top
C2  109.92,32.13 270 top
C3  77.5,56.52 270 top
C4  72.55,65.92 270 top
C5  73.32,70.01 90 top
C6  43.09,21.47 270 top
C7T  53.63,21.03 180 top
C8  41.34,25.47 270 top
C10  54.83,68.24 270 top
C11T  88.47,58.34 90 top
C16  65.44,73.94 0 top
C18T  100.6,57.18 0 top
C19  70.47,47.74 0 top
C21  90.38,18.08 90 top
C22  89.21,24.49 270 top
C23  43.09,54.72 270 top
C24  43.09,29.47 270 top
C25  43.09,47.22 270 top
C48  84.4,60.68 0 top
CH_PD  90.34,6.72 0 top
CR1220  50.44,21.94 270 bottom
D1  65.69,62.65 270 top
D2  38.34,55.47 90 top
D3  38.34,46.47 270 top
D4  38.34,29.97 90 top
D5  38.34,20.97 270 top
D6  41.79,67.87 0 top
ESP-12  85.68,24.89 180 top
F1  34.34,72.72 0 top
FTDI_ESP  84.05,26.42 180 top
FTDI_RFM  109.59,26.54 180 top
GND  64.36,55.26 270 top
GPIO_1  85.83,28.73 0 top
IO16  94.02,18.34 0 top
J5  63.58,34.43 180 top
L1  85.11,69.06 90 top
LED1  83.84,39.22 0 top
LOGO1  79.79,3.32 0 bottom
MCP3208  63.03,41.87 270 top
MH1  7.84,44.72 0 top
MH2  7.84,57.22 0 top
MH3  7.84,19.22 0 top
MH4  7.84,31.72 0 top
MICRO_SD  46.63,1.59 90 top
P1  61.84,5.82 270 top
PCF8523  57,15.56 90 top
PWR  42.5,63.17 180 top
R1  45.41,19.42 90 top
R2  47.86,18.19 90 top
R3  66.05,20.46 180 top
R4  70.24,40.76 0 top
R6  66.06,18.41 180 top
R7  91.48,12.42 0 top
R8  74.06,40.75 0 top
R9  54.22,24.56 90 top
R10  77.59,47.47 0 top
R11  77.59,44.97 0 top
R12  66.07,16.28 180 top
R14  45.39,44.97 90 top
R15  47.8,43.8 90 top
R16  34.09,52.97 0 top
R17  66.08,12.53 0 top
R18  66.06,10.37 180 top
R19  91.4,14.89 0 top
R20  75.39,73.83 0 top
R21  71.4,73.88 0 top
R22  34.09,48.97 0 top
R23  34.09,27.47 0 top
R24  34.09,23.47 0 top
R25  97.79,35.79 0 top
R26  87.34,38.22 0 top
R27  57.02,21.75 270 top
R28  60.21,21.74 270 top
REF_SEL_A  47.34,56.46 0 top
REF_SEL_B  47.34,32.63 0 top
REG0  67.39,69.74 180 top
REG1  90.84,51.57 180 top
REG2  99.84,51.56 180 top
RX  104.31,20.62 180 top
SCREW_TERM_1  18.59,50.97 90 top
SCREW_TERM_2  18.59,25.47 90 top
SHUNTMON-A  46.34,50.97 0 top
SHUNTMON-B  46.34,25.47 0 top
SJ1  [SJ-CON']  70.58,44.32 0 top
SJ2  [SJ-CON']  56.85,25.06 180 top
SJ3  [SJ-CON']  89.6,31.92 180 top
SJ4  84.23,55.87 270 top
SJ5  [SJ-CON']  90.84,42.22 270 top
SJ6  [SJ-CON']  99.84,42.22 270 top
TP1  90.84,45.22 0 top
TP2  99.84,45.22 0 top
TP3  93.63,63.03 0 top
TX  106.84,20.65 0 top
U1  52.34,41.22 180 top
U$1  [DRAGON_LOGO_NOTEXT]  28.75,6.15 0 bottom
U$2  [ALIGNMENT_STOP]  21.34,9.22 0 top
U$3  [ALIGNMENT_STOP]  94.34,67.22 0 top
X3  28.34,50.97 90 top
X4  28.34,25.47 90 top
Y1  55.54,6.59 270 top

### Tracks (layer width: path | path; a pad name or v marks a point on that pad's centre or on a via)
3.3V_PRE
  Top 0.406: REG2.2 99.81,48.44 REG2.4 TP2.TP SJ6.1 | 99.81,57.11 C18T.1
  Top 0.508: REG2.2 99.81,57.11
5V_PRE
  Top 0.406: REG1.2 90.84,54.69 REG1.4 TP1.TP SJ5.1
  Top 0.508: REG1.2 90.78,54.75 C1T.1
6.5V
  Top 0.508: REG1.3 88.47,54.77 C11T.1
  Top 1.016: SJ4.2 84.62,54.72 REG1.3
+3V3  (via drill 0.5)
  Top 0.254: MCP3208.6 59.58,39.96 57.34,37.72 57.34,32.72
  Top 0.406: GPIO_1.2 106.37,60.13 98.64,60.13 96.96,58.45 96.96,57.06 95.23,55.33 95.23,44.45 97.9,41.78 | 97.9,41.78 98.21,41.47 SJ6.2 | 97.9,41.78 94.34,38.22 R26.2 88.19,35.22 | 88.19,35.22 88.19,32.57 SJ3.2 | 88.19,35.22 v77.84,35.22 | v68.34,26.72 v68.34,33.22 67.84,32.72 57.34,32.72 57.34,27.22 | 57.34,27.22 57.34,25.33 SJ2.1 57.61,23.2 R27.1 60.2,22.6 R28.1 60.41,22.59 v61.61,23.79 | MICRO_SD.PIN4 42.69,8.37 41.84,9.22 41.84,12.22 42.84,13.22 48.34,13.22 51.73,16.62 51.91,16.62 52.44,17.14 52.44,19.05 51.17,20.32 51.17,23.5 51.93,24.26 51.93,25.92 53.24,27.22 57.34,27.22
  Bottom 0.406: v77.84,35.22 70.34,35.22 v68.34,33.22 | v61.61,23.79 61.61,16.71 62.35,15.97 3.3V_BAT.1 | P1.3 61.84,5.31 59.87,7.29 59.87,13.03 60.4,13.56 62.22,13.56 62.35,13.69 3.3V_BAT.1 | 62.35,15.63 3.3V_BAT.1
+5V  (via drill 0.5)
  Top 0.254: v55.09,39.47 U1.8
  Top 0.406: R10.2 83.33,47.47 85.21,45.59 | v93.93,41.45 90.85,41.45 SJ5.2 89.34,41.46 85.21,45.59 | v96.69,53.33 96.69,53.88 REG2.3 | v93.84,36.72 93.84,34.61 95.55,32.89 98.29,32.89 101.97,29.21 FTDI_RFM.4 | v71.75,46 71.75,44.73 SJ1.2 72.94,42.72 76.34,42.72 | 85.21,45.59 82.34,42.72 76.34,42.72 | FTDI_ESP.4 76.43,42.63 76.34,42.72
  Bottom 0.254: 76.52,26.45 FTDI_ESP.4 | v71.75,46 69.97,44.22 69.11,44.22 68.21,45.11 67.52,45.11 66.63,44.22 56.84,44.22 56.84,41.22 v55.09,39.47 54.84,39.22
  Bottom 0.406: v96.69,53.33 96.69,44.2 v93.93,41.45 93.84,41.35 v93.84,36.72
_RESET
  Top 0.254: 107.8,51.18 GPIO_1.8 106.32,51.09 105.78,50.55 105.78,41.91 109.97,37.72 109.97,33.03 C2.1
ADC  (via drill 0.5)
  Top 0.254: ESP-12.10 86.87,10.89 v87.81,9.95
  Bottom 0.254: v87.81,9.95 87.81,5.75 90.84,2.72 94.52,2.72 ADC-PAD.1
ADCSHUNT_A
  Top 0.254: SHUNTMON-A.5 47.37,53.2 52.4,53.2 59.15,46.46 59.37,46.46 59.6,46.23 60.29,46.23 MCP3208.1
ADCSHUNT_B  (via drill 0.48, 0.5)
  Top 0.254: v53.09,30.68 50,27.6 47.37,27.6 SHUNTMON-B.5 | v58.8,43.37 59.15,43.37 59.6,43.83 60.29,43.83 MCP3208.3
  Bottom 0.254: v53.09,30.68 58,35.6 58,42.57 v58.8,43.37
BST
  Top 0.254: 70.23,67.72 70.12,67.83 REG0.1
  Top 0.61: C4.1 71.18,66.77 70.12,67.83
CH6
  Top 0.254: MCP3208.7 60.29,38.68 59.95,38.68 58.46,37.2 58.46,36.63 59.72,35.37 59.83,35.37 60.74,34.45 60.97,34.45 J5.2
CH7
  Top 0.254: MCP3208.8 60.4,37.43 61.2,37.43 61.32,37.31 61.55,37.31 62.69,36.17 62.69,36.05 63.49,35.26 63.49,34.45 J5.1
CH_PD
  Top 0.254: 88.86,12.51 87.72,12.51 87.49,12.74 85.89,12.74 85.78,12.85 ESP-12.11 | 88.86,12.51 88.98,12.51 | 88.98,12.51 90.58,12.51 R7.1 | 88.86,12.51 88.86,16.28 89.43,16.85 89.99,16.85 C21.1 | 88.98,12.51 88.98,11.37 89.21,11.14 89.21,8.39 90.23,7.37 90.23,6.79 CH_PD.1
D0/RX
  Bottom 0.254: TX.2 109.32,20.74 109.32,20.97 108.18,22.11 108.18,24.4 107.04,25.54 107.04,26.34 FTDI_RFM.2 107.07,31.94 112.34,37.2 112.34,50.72 111.97,51.09 GPIO_1.7
D1/TX
  Bottom 0.254: RX.1 104.29,20.62 104.29,21.43 104.06,21.65 104.06,22 103.72,22.34 103.72,24.17 104.41,24.85 104.41,26.45 FTDI_RFM.3 104.53,31.42 110.84,37.72 110.84,48.05 GPIO_1.9
ESPRX  (via drill 0.48)
  Top 0.254: R17.2 66.92,12.51 66.92,10.45 R18.1 67.03,10.57 67.6,10.57 67.83,10.79 68.29,10.79 68.52,10.57 69.2,10.57 69.43,10.79 ESP-12.7 69.55,10.91 v71.26,10.91
  Bottom 0.254: v71.26,10.91 91.83,10.91 101.44,20.51 101.66,20.51 RX.2
ESPTX  (via drill 0.48)
  Top 0.254: v79.72,23.37 79.72,17.54 71.15,8.97 69.55,8.97 ESP-12.8 | TX.1 106.81,20.74 106.81,21.31 104.29,23.83 94.66,23.83 89.4,29.08 82.8,29.08 81.55,27.83 81.55,26.45 FTDI_ESP.2
  Bottom 0.254: v79.72,23.37 81.43,25.08 81.43,26.34 FTDI_ESP.2
GND  (via drill 0.5, 3.2 pad 5.59)
  other vias: 16.68,67.2 98.67,67.22 16.68,9.19 98.67,9.19 47.77,47.48 47.89,21.98 52.91,61.96 54.91,66.96 56.91,61.96 71.7,70.41 67.34,70.41 67.62,73.16 67.12,61.13 64.23,61.07 65.69,59.43 68.47,58.63 73.66,72.31 75.66,53.31 75.7,54.61 76.23,55.9 67.87,44.28 102.78,57.03 93.89,57.54 94.45,56.45 103.55,56.05 101.95,37.95 75.07,38.94 40.27,57.98 40.27,43.98 40.27,32.48 40.14,18.48 41.97,6.16 67.64,23.46 89.3,26.74 67.36,36.64 54.77,49.48 66.77,55.34 61.04,55.24 63.23,22.41 62.93,19.69 41.38,7.33 41.26,4.89 76.45,70.46 71.28,21.84 55.27,51.98 48.77,29.48 52.88,22.48 58.91,11.4 63.87,10.3 38.62,59 37.39,56.94 38.26,42.84 37.73,41.59 38.27,16.85 38.3,20 38.27,33.98 37.92,35.4 86.81,62.01 71.21,36.65 67.93,42.81 67.34,71.91 67.34,68.91 56.91,63.46 56.91,64.96 52.91,63.46 52.91,64.96 52.91,66.46 56.91,66.46 67.62,74.66 69.12,74.66 69.12,73.16 46.36,68.52 46.36,67.52 46.36,66.52 44.36,65.52 65.71,31.65 65.71,30.15 72.71,36.65 88.31,62.01 89.81,62.01 58.04,1.74 56.54,1.74 63.47,3.58 74.43,22.07
  pour Bottom (isolate 0.813, rank 3): 13.45,76.2 13.45,66.14 36.57,66.27 36.57,10.43 13.45,10.3 13.45,0.25 102.35,0.25 102.35,12.95 113.9,12.95 113.9,63.5 102.35,63.5 102.35,76.2
  pour Top (isolate 0.356, rank 3, no thermals): 13.45,76.33 13.45,66.16 36.69,66.04 36.69,10.25 13.45,10.38 13.45,0.25 102.35,0.25 102.35,12.95 113.9,12.95 113.9,63.5 102.35,63.5 102.35,76.2
GPIO0
  Top 0.254: BOOT.2 63.6,26.45 63.83,26.45 65.09,25.2 70.23,25.2 72.4,23.03 72.4,18.23 71.15,16.97 69.55,16.97 ESP-12.4 67.52,16.89 R12.1
GPIO2  (via drill 0.48, 0.5)
  Top 0.254: v71.26,19.25 71.03,19.03 69.66,19.03 69.55,18.91 ESP-12.3 67.4,18.89 R6.1 | v69.77,28.22 69.77,36.23 67.31,38.69 MCP3208.10
  Bottom 0.254: v71.26,19.25 69.77,20.74 v69.77,28.22
GPIO12  (via drill 0.5)
  Top 0.254: MICRO_SD.PIN7 57.69,5.07 v58.34,5.72 | v81.84,15.72 83.84,17.72 83.84,18.72 | 83.84,18.72 84.01,18.89 ESP-12.14 | R4.2 R8.1 73.21,38.36 v74.24,37.33 | v78.34,37.22 78.34,36.9 77,35.57 77,30.7 80.19,27.77 80.19,24.32 80.67,23.58 80.67,21.89 83.84,18.72
  Bottom 0.254: v58.34,5.72 60.34,3.72 60.34,1.22 63.34,1.22 65.34,3.22 65.34,6.22 74.84,15.72 v81.84,15.72 | v74.24,37.33 78.23,37.33 v78.34,37.22
GPIO12A
  Top 0.254: MCP3208.12 68.33,41.23 68.8,40.76 R4.1
GPIO13  (via drill 0.5)
  Top 0.254: MICRO_SD.PIN3 51.74,9.47 52.85,8.36 59.59,8.36 61.04,9.81 62.75,9.81 64.83,7.73 71.34,7.73 v81.34,17.72 | v81.84,23.22 82.24,23.22 83.61,21.86 84.72,21.86 ESP-12.15 84.51,20.89 v83.84,20.22 | v74.84,29.22 70.23,33.83 70.23,36.42 67.84,38.81 67.84,39.72 67.6,39.96 MCP3208.11
  Bottom 0.254: v81.84,23.22 80.74,23.22 80.06,22.54 79.38,22.54 77.65,24.27 77.65,27.51 75.94,29.22 v74.84,29.22 | v81.34,17.72 v83.84,20.22
GPIO14  (via drill 0.5)
  Top 0.254: MICRO_SD.PIN5 60.88,7.27 61.43,7.81 62.25,7.81 62.79,7.27 74.96,7.27 83.59,15.9 v83.59,15.99 83.59,16.17 84.32,16.89 85.01,16.89 ESP-12.13 | MCP3208.13 66.35,41.88 73.59,41.88 74.04,41.44 74.04,38.71 75.9,36.85 75.9,28.32 75.21,27.64 75.21,25.08 76.34,24.09 v76.34,20.22
  Bottom 0.254: v76.34,20.22 80.32,20.22 83.61,23.51 84.29,23.51 84.77,23.02 84.77,22.34 80.38,17.95 80.38,16.91 80.74,16.56 83.02,16.56 v83.59,15.99
GPIO15  (via drill 0.5)
  Top 0.254: MICRO_SD.PIN2 48.19,10.57 54.34,16.72 v60.1,16.72 | v60.58,19.24 62.21,20.87 63.8,20.87 64.72,21.79 66.56,21.79 66.9,21.45 R3.1 67.33,20.89 ESP-12.2
  Bottom 0.254: v60.1,16.72 60.1,18.76 v60.58,19.24
GPIO16/RST  (via drill 0.48)
  Top 0.254: R19.1 90.58,14.91 90.58,15.25 93.66,18.34 94.01,18.34 IO16.1 | v87.49,14.91 85.78,14.91 | 85.78,14.91 ESP-12.12 | ESP-12.9 84.17,8.89 82.84,10.22 82.84,13.22 84.53,14.91 85.78,14.91
  Bottom 0.254: v87.49,14.91 89.43,14.91 92.63,18.11 93.09,18.11 93.32,18.34 94.01,18.34 IO16.1
LOAD-NEG-A
  pour Top (no thermals): 0.34,62.72 33.34,62.72 33.34,51.72 0.34,51.72
  pour Bottom (isolate 0.813, no thermals): 33.34,62.72 0.34,62.72 0.34,51.72 33.34,51.72
LOAD-NEG-B
  pour Top (no thermals): 0.34,37.22 33.34,37.22 33.34,26.22 0.34,26.22
  pour Bottom (isolate 0.813, no thermals): 33.34,37.22 0.34,37.22 0.34,26.22 33.34,26.22
LX
  Top 0.254: 64.74,67.83 REG0.8 | D1.C 65.74,64.81 66.1,65.17
  Top 0.61: D1.C 65.69,66.88 64.74,67.83 | C4.2 72.34,64.86 72.34,64.72
  Top 1.016: L1.1 79.68,69.06 75.34,64.72 72.34,64.72 65.84,64.72 65.74,64.81
MCP_VCC
  Top 0.254: 69.55,47.71 68.17,47.71 66.92,46.46 66.69,46.46 66.46,46.23 65.77,46.23 MCP3208.16 65.77,46.11 65.77,45.09 MCP3208.15 | 69.55,47.71 C19.1 | SJ1.1 69.81,47.45 69.55,47.71
N$1
  Top 0.406: R21.2 72.25,72.63 71.26,71.65 REG0.4
  Top 0.508: R21.2 72.3,73.83 R20.1
N$3
  Top 0.254: 83.55,16 83.68,16
N$5
  Top 0.254: R26.1 86.46,38.23 83.95,38.23 LED1.A
N$10
  Top 0.254: R9.1 54.12,23.6 54.12,22.68 54.46,22.34 54.46,21.08 C7T.1 54.34,21.08 54.34,20.05 54.23,19.94 55.03,19.14 55.03,18.34 PCF8523.8
N$17
  Top 0.254: D2.C 38.34,52.97
  Top 0.305: R16.2 38.34,52.97 41.34,52.97 | 41.34,52.97 43.34,52.97 | 43.34,52.97 45.36,52.97 SHUNTMON-A.8 | C1.1 41.34,52.97 | C23.2 43.34,53.87 43.34,52.97
N$22
  Top 0.254: 35.14,27.37 R23.2 35.14,27.48
  Top 0.305: R23.2 38.34,27.47 | 38.34,27.47 41.34,27.47 | 41.34,27.47 43.34,27.47 | 43.34,27.47 45.36,27.47 SHUNTMON-B.8 | D4.C 38.23,27.42 38.23,27.48 38.23,27.47 38.34,27.47 | C8.1 41.34,27.47 | C24.2 43.09,27.47 43.34,27.47
N$23
  Top 0.254: 45.66,48.51 45.66,47.48 45.43,47.26 45.43,45.88 R14.2 | 45.66,48.51 45.43,48.74 SHUNTMON-A.1 | SHUNTMON-A.2 46,48.74 45.77,48.51 45.66,48.51
  Top 0.305: R22.2 38.34,48.97 | 38.34,48.97 41.34,48.97 | 41.34,48.97 43.34,48.97 | 43.34,48.97 45.36,48.97 SHUNTMON-A.1 | D3.C 38.34,48.97 | C1.2 41.34,48.97 | C25.1 43.34,48.07 43.34,48.97
N$24
  Top 0.254: R9.2 55.2,25.41 55.55,25.06 SJ2.2
N$30  (via drill 0.5)
  Top 0.254: v88.97,18.95 90.36,18.95 C21.2
  Bottom 0.254: FTDI_ESP.1 85.84,24.64 85.84,20.72 87.61,18.95 v88.97,18.95
N$36
  Top 0.254: R17.1 65.32,12.62 66.12,13.42 67.6,13.42 67.83,13.2 67.83,12.39 68.29,11.94 70.69,11.94 78,19.25 78,24.17 78.92,25.08 78.92,26.34 FTDI_ESP.3
N$44
  Top 0.254: PCF8523.2 56.4,12.85 56.4,12.17 56.29,12.05 56.29,11.14 56.63,10.79 56.63,9.88 57.09,9.42 Y1.P$4
N$45
  Top 0.254: PCF8523.1 55.03,12.85 55.03,12.05 54.92,11.94 54.92,11.82 54.34,11.25 54.34,9.77 54,9.42 Y1.P$1
N$301
  Top 0.254: C2.2 109.92,26.77 FTDI_RFM.1
PRE_6.5V
  Top 0.508: R20.2 85.34,73.83 L1.2
  Top 1.016: 83.8,62.76 83.55,62.51 C48.1 83.55,57.31 SJ4.1 | L1.2 91.34,67.83 91.34,64.72 93.03,63.03 TP3.TP
  Top 1.27: L1.2 83.8,62.76 80.68,59.64 C3.1
REF_A_INPUT
  Top 0.254: SHUNTMON-A.7 46.11,53.2 46.57,53.2 SHUNTMON-A.6 46.57,53.32 46.57,54 47.72,55.14 48.29,55.14 49.54,56.4 49.77,56.4 REF_SEL_A.2
REF_B_INPUT
  Top 0.254: SHUNTMON-B.7 46.11,27.6 46.57,27.6 SHUNTMON-B.6 46.69,27.71 46.69,29.2 49.77,32.28 49.77,32.63 REF_SEL_B.2
REF_INPUT
  Top 0.254: REF_SEL_B.3 52.52,32.74 52.52,32.97 55.72,36.17 55.72,38.23 58.69,41.2 60.29,41.2 MCP3208.5 60.4,41.2 61.32,41.2 61.43,41.08 61.55,41.08 61.73,41.27 61.73,47.62 61.71,47.64 | REF_SEL_A.3 52.52,56.4 61.71,47.64 | R10.1 73.85,47.75 72.17,49.43 64.63,49.43 62.84,47.64 61.71,47.64
  Top 0.406: R11.2 R10.1
SCL  (via drill 0.5)
  Top 0.254: R27.2 57.6,20.32 v57.6,19.37 | v57.6,19.37 PCF8523.6 v57.6,19.37 | ESP-12.6 69.89,13.3 70.79,13.3 71.58,14.09 v71.58,15.03 | v60.78,12.65 60.78,13.97 v58.87,15.89
  Bottom 0.254: v71.58,15.03 63.38,6.82 P1.2 60.78,7.88 v60.78,12.65 | v58.87,15.89 57.6,17.16 v57.6,19.37
SDA  (via drill 0.5)
  Top 0.254: 64.34,14.72 60.8,18.26 PCF8523.5 58.9,19.26 59.21,19.57 59.21,19.89 R28.2 | 64.34,14.72 69.31,14.72 ESP-12.5 | 64.34,14.72 62.47,12.85 v62.47,11.47
  Bottom 0.254: v62.47,11.47 62.47,9.45 P1.1
SOURCE-POS-A
  Bottom 1.016: X3.1 32.84,51.66 32.84,60.72 35.28,63.17 PWR.3
  pour Top (no thermals): 0.34,50.22 33.34,50.22 33.34,39.22 0.34,39.22
  pour Bottom (isolate 0.813, no thermals): 33.34,50.22 0.34,50.22 0.34,39.22 33.34,39.22
SOURCE-POS-B
  Bottom 1.016: X4.1 33.84,27.16 33.84,48.22 34.84,49.22 34.84,60.22 35.84,61.22 41.84,61.22 42.49,61.88 PWR.1
  pour Top (no thermals): 0.34,24.72 33.34,24.72 33.34,13.72 0.34,13.72
  pour Bottom (isolate 0.813, no thermals): 33.34,24.72 0.34,24.72 0.34,13.72 33.34,13.72
SOURCE-POS-B_T
  Top 0.254: 45.66,23.03 45.66,22 45.43,21.77 45.43,20.28 R1.2 | 45.66,23.03 45.43,23.25 SHUNTMON-B.1 | SHUNTMON-B.2 46,23.25 45.77,23.03 45.66,23.03
  Top 0.305: R24.2 38.34,23.47 | 38.34,23.47 41.34,23.47 | 41.34,23.47 42.84,23.47 | 42.84,23.47 45.36,23.47 SHUNTMON-B.1 | D5.C 38.34,23.47 | C8.2 41.34,23.47 | 42.84,23.47 43.09,23.47 C6.1
V_IN1
  Top 1.27: D6.C 39.95,67.16 PWR.2
  Bottom 1.27: PWR.2 39.95,65.6 32.84,72.72 F1.P$2 F1.P$1
V_IN2
  Top 0.254: 64.63,69.09 REG0.7
  Top 0.508: 63.95,69.09 64.63,69.09 | C16.1 64.59,71.79 REG0.5
  Top 0.61: REG0.5 63.67,71.65 arc90 62.52,70.5 arc90 63.93,69.09 64.63,69.09
  Top 1.27: F1.P$3 54.83,72.72 C10.1 59.79,73.22 62.52,70.5
  Bottom 1.27: F1.P$4 F1.P$3
VBAT  (via drill 0.5)
  Top 0.254: v57.6,15.04 57.6,15.03 PCF8523.3
  Bottom 0.254: CR1220.P+ 51.84,15.04 v57.6,15.04 60.24,15.04 60.24,14.97 | 60.24,14.97 60.24,15.22 60.24,14.97 | 60.24,14.97 3.3V_BAT.2
VCC_ESP  (via drill 0.48, 0.5)
  Top 0.254: R7.2 92.29,12.51 92.29,14.79 R19.2 92.41,14.79 94.92,14.79 97.89,17.77 97.89,18.88 v93.32,23.45 | R12.2 65.2,16.4 65.2,18.34 R6.2 65.09,18.34 v63.95,18.34 | 89.21,23.6 C22.2 89.32,23.6 | 85.78,22.91 ESP-12.16 85.66,22.91 84.18,22.91 v83.95,22.68
  Top 0.406: 89.21,23.6 87.95,23.6 87.26,22.91 85.78,22.91 | v93.32,23.45 93.17,23.6 89.32,23.6 | SJ3.1 90.36,30.54 93.42,27.48 93.42,26.8 v93.34,26.72
  Bottom 0.254: v63.95,18.34 79.6,18.34 v83.95,22.68
  Bottom 0.406: v93.34,26.72 93.34,23.47 v93.32,23.45
VD
  Top 0.508: C5.1 73.32,69.11 REG0.2
VSENSE_A
  Top 0.254: R14.1 45.43,44.17 46.69,44.17 47.03,44.51 47.6,44.51 47.72,44.63 R15.2 47.83,44.74 48.29,44.74 49.66,46.11 50.12,46.11 51.6,44.63 51.6,43.83 U1.3
VSENSE_A_BUFF
  Top 0.254: MCP3208.2 60.29,45.09 55.94,45.09 54.92,44.06 54.46,44.06 54.22,43.82 | U1.2 54.22,43.82 | U1.1 54.22,43.82
VSENSE_B  (via drill 0.48)
  Top 0.254: R1.1 45.43,18.57 46.69,18.57 47.03,18.91 47.72,18.91 47.83,19.03 R2.2 47.83,19.14 v47.83,20.28 | v49.43,37.88 49.89,38.34 50.23,38.34 50.46,38.57 50.46,38.6 U1.5
  Bottom 0.254: v47.83,20.28 47.83,20.62 45.54,22.91 45.54,34 v49.43,37.88
VSENSE_B_BUFF
  Top 0.254: MCP3208.4 60.29,42.46 56.06,42.46 53.09,39.48 53.09,38.68 53.04,38.68 U1.7
  Top 0.406: U1.6 U1.7

### Text on the board
bPlace: emonDC | wireless energy monitoring node | Technology that helps us live within ecological limits | Designed in North Wales UK / by Daniel Bates | OpenEnergyMonitor.org | Designed in | North Wales | Made in UK | Lead free PCB - RoHS components | Open-Hardware
tNames: 100uF | 80V | ***WARNING*** / FLOATING / VOLTAGES | 150uH | - | A | B | LOAD | 16V | 470uF | A | LMP8481 | SOURCE | + | - | CH6 CH7 | LOAD | B | LMP8481 | SOURCE | + | LCD | I2C
tSilk: RFM69Pi | REF | GND | REF | GND | GND | 5V | Tx | Rx | RST | GND | TX / RX / RFM | emonDC / _duo_ | Wireless Energy / Monitoring Node | v2.2 Jul 2018 by DB
_tsilk: Designed in | North Wales | Made in UK
_bsilk: SMT V0.6 rev3 | emonTx | wireless energy monitoring node | SMT V0.6 rev3 | emonTx | SMT V0.6 rev3 | emonTx | Technology that helps us live within ecological limits | wireless energy monitoring node | wireless energy monitoring node | Designed in North Wales UK by Glyn Hudson & Trystan Lea | Technology that helps us live within ecological limits | Technology that helps us live within ecological limits | Designed in North Wales UK by Glyn Hudson & Trystan Lea | 165mm ant | 433Mhz | Designed in North Wales UK by Glyn Hudson & Trystan Lea | 165mm ant | 165mm ant | 433Mhz | 433Mhz | 868Mhz | 82mm ant | 82mm ant | 82mm ant | 868Mhz | 868Mhz | 78mm ant | 915Mhz | 78mm ant | 915Mhz | 78mm ant | 915Mhz | 165mm ant | 433Mhz | 82mm ant | 868Mhz | 78mm ant | 915Mhz